# Altium project Intern_assign1.PrjPcb
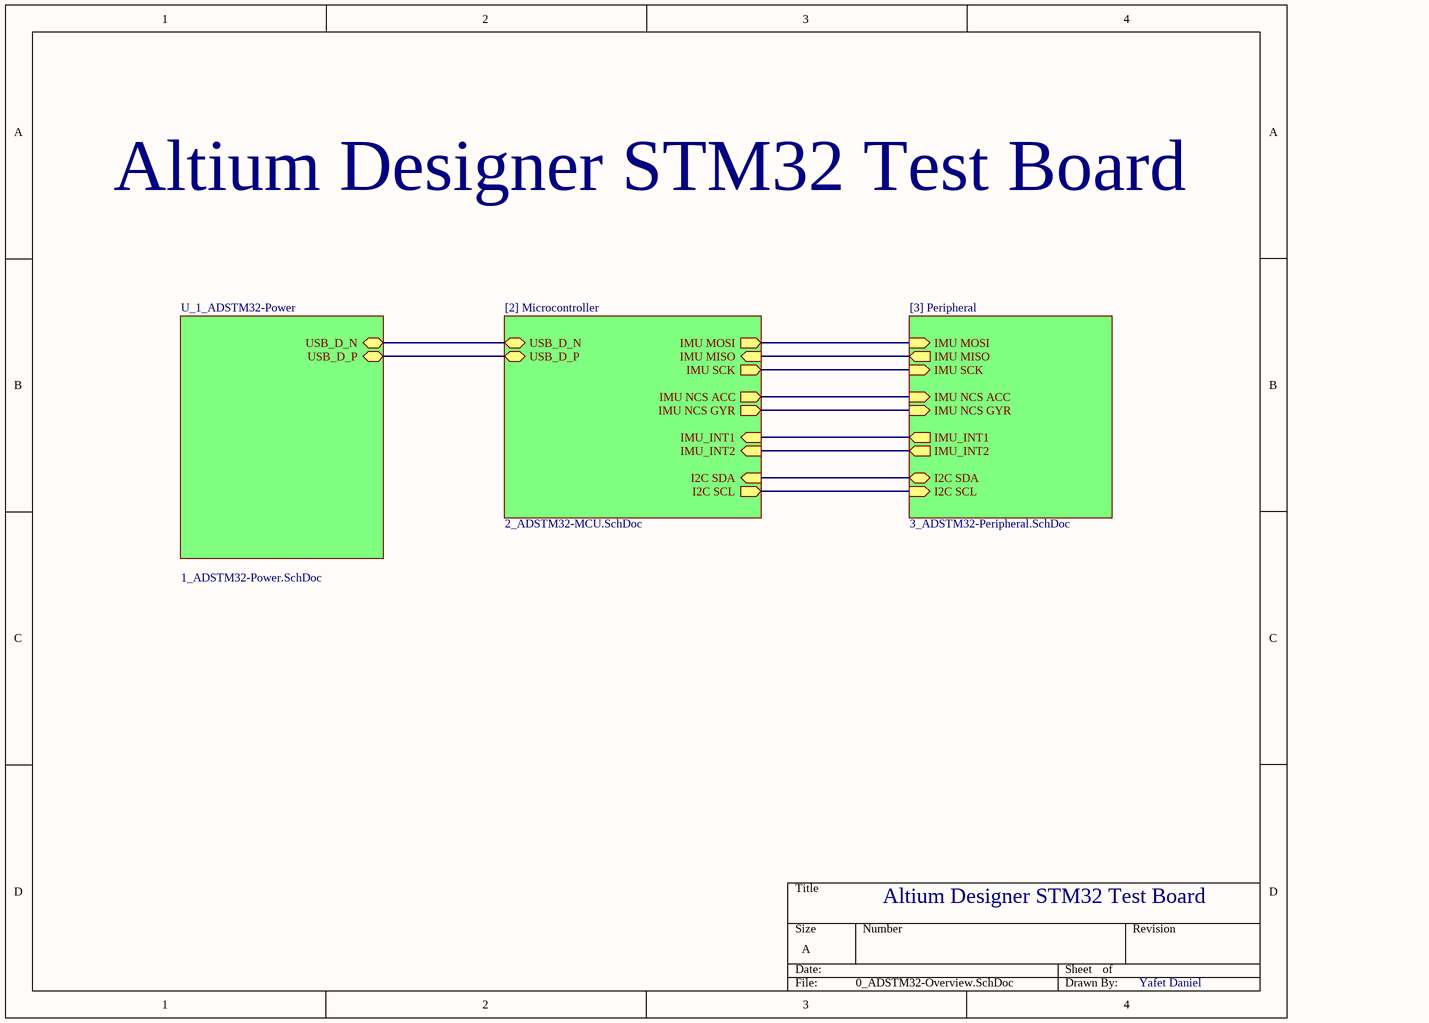
[diagram p0: 0_ADSTM32-Overview.SchDoc]
4 sheets, 30 parts. Net scope: hierarchical (ports join the sheet entries above them; power ports are global).
Board file: ADSTM32-PCB.PcbDoc
Sheets:
  0_ADSTM32-Overview.SchDoc
    U_1_ADSTM32-Power = 1_ADSTM32-Power.SchDoc
    [3] Peripheral = 3_ADSTM32-Peripheral.SchDoc
    [2] Microcontroller = 2_ADSTM32-MCU.SchDoc

## Sheet 0_ADSTM32-Overview.SchDoc
size A; SheetNumber: 1; SheetTotal: 4

### Sub-sheets
[2] Microcontroller = 2_ADSTM32-MCU.SchDoc: USB_D_N (bidir), USB_D_P (bidir), IMU NCS ACC (out), IMU NCS GYR (out), IMU SCK (out), IMU MOSI (out), IMU MISO (in), I2C SCL (out), I2C SDA (in), IMU_INT1 (in), IMU_INT2 (in)
[3] Peripheral = 3_ADSTM32-Peripheral.SchDoc: IMU SCK (in), IMU MOSI (in), IMU MISO (out), IMU NCS ACC (in), IMU NCS GYR (in), IMU_INT1 (out), IMU_INT2 (out), I2C SCL (in), I2C SDA (bidir)
U_1_ADSTM32-Power = 1_ADSTM32-Power.SchDoc: USB_D_N (bidir), USB_D_P (bidir)

### Nets
I2C SCL: sheet [3] Peripheral/I2C SCL, sheet [2] Microcontroller/I2C SCL
I2C SDA: sheet [3] Peripheral/I2C SDA, sheet [2] Microcontroller/I2C SDA
IMU MISO: sheet [3] Peripheral/IMU MISO, sheet [2] Microcontroller/IMU MISO
IMU MOSI: sheet [3] Peripheral/IMU MOSI, sheet [2] Microcontroller/IMU MOSI
IMU NCS ACC: sheet [3] Peripheral/IMU NCS ACC, sheet [2] Microcontroller/IMU NCS ACC
IMU NCS GYR: sheet [3] Peripheral/IMU NCS GYR, sheet [2] Microcontroller/IMU NCS GYR
IMU SCK: sheet [3] Peripheral/IMU SCK, sheet [2] Microcontroller/IMU SCK
USB_D_N: sheet U_1_ADSTM32-Power/USB_D_N, sheet [2] Microcontroller/USB_D_N
USB_D_P: sheet U_1_ADSTM32-Power/USB_D_P, sheet [2] Microcontroller/USB_D_P
NetU200_14: sheet [3] Peripheral/IMU_INT2, sheet [2] Microcontroller/IMU_INT2
NetU200_15: sheet [3] Peripheral/IMU_INT1, sheet [2] Microcontroller/IMU_INT1

### Notes on the sheet
- Altium Designer STM32 Test Board
- Yafet Daniel

## Sheet 1_ADSTM32-Power.SchDoc
size A; SheetNumber: 2; SheetTotal: 4
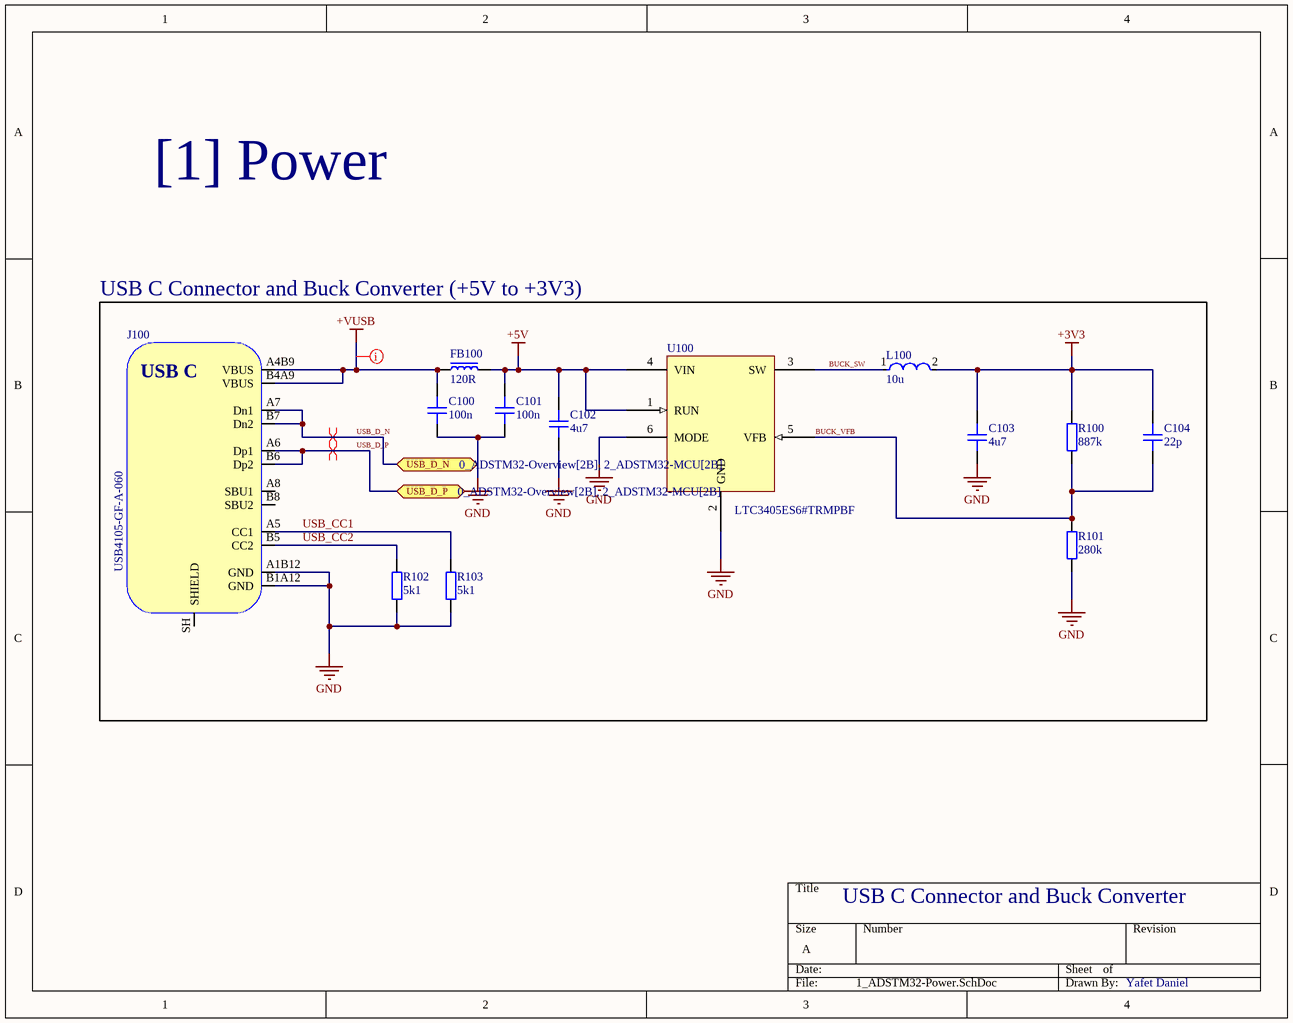
[diagram p1: 1_ADSTM32-Power.SchDoc]

### Parts
C100  100n  [CAP_0603]
C101  100n  [CAP_0603]
C102  4u7  [CAP_0805]
C103  4u7  [CAP_0805]
C104  22p  [CAP_0603]
FB100  120R  [FB_0402]
J100  USB4105-GF-A-060  [USB4105-GF-A-060]
L100  10u  [FP-NRH2412-MFG]
R100  887k  [RES_0603]
R101  280k  [RES_0603]
R102  5k1  [RES_0603]
R103  5k1  [RES_0603]
U100  LTC3405ES6#TRMPBF  [SOT-23-6]

### Blocks framed on the sheet
USB C Connector and Buck Converter (+5V to +3V3): C100-C104 FB100 J100 L100 R100-R103 U100

### Ports
USB_D_N (bidir, see 0_ADSTM32-Overview[2B], 2_ADSTM32-MCU[2B]), USB_D_P (bidir, see 0_ADSTM32-Overview[2B], 2_ADSTM32-MCU[2B])

### Nets
+3V3: C103.2 C104.2 L100.2 R100.2
+5V: C101.2 C102.2 FB100.2 U100.1(RUN) U100.4(VIN)
+VUSB: C100.2 FB100.1 J100.A4B9(VBUS) J100.B4A9(VBUS)
GND: C100.1 C101.1 C102.1 C103.1 J100.A1B12(GND) J100.B1A12(GND) R101.1 R102.1 R103.1 U100.2(GND) U100.6(MODE)
BUCK_SW: L100.1 U100.3(SW)
BUCK_VFB: C104.1 R100.1 R101.2 U100.5(VFB)
USB_CC1: J100.A5(CC1) R103.2
USB_CC2: J100.B5(CC2) R102.2
USB_D_N: J100.A7(Dn1) J100.B7(Dn2) ; port USB_D_N
USB_D_P: J100.A6(Dp1) J100.B6(Dp2) ; port USB_D_P

Not connected (* = marked no-connect by the designer): J100 A8(SBU1) B8(SBU2) SH(SHIELD)

### Layout directives
differential pair: USB_D_N, USB_D_P

### Notes on the sheet
- [1] Power
- USB C Connector and Buck Converter
- Yafet Daniel
- (in symbol USB4105-GF-A-060) USB C

### Library data of the parts
C100 C101 C104 = CAP_0603: Capacitor SMD 0603; Manufacturer: *; Manufacturer Part Number: *; Distributor Link: *; LCSC: *; Rating: *; Dielectric: *
C102 C103 = CAP_0805: Capacitor SMD 0805; Manufacturer: *; Manufacturer Part Number: *; Distributor Link: *; LCSC: *; Rating: *; Dielectric: *
FB100 = FB_0402: Ferrite Bead SMD 0402; Manufacturer: *; Manufacturer Part Number: *; Distributor Link: *; LCSC: *
J100 = USB4105-GF-A-060: USB Connector Type C SMT 12 Pin; Manufacturer: GCT; Manufacturer Part Number: USB4105-GF-A-060; Distributor Link: https://eu.mouser.com/ProductDetail/GCT/USB4105-GF-A-060?qs=QNEnbhJQKvY2mocwNJzgfA%3D%3D; Component Type: Source
L100 = CMP-14484-000582-1: Shielded Wirewound Inductor 10uH 20% 0.51A 0.72Ω SMD; DC Resistance (DCR): 600mR; Current Rating: 450mA; Saturation Current: 810mA; Core Material: Ferrite; Test Frequency: 100kHz; Self Resonant Frequency: 29MHz; Termination: SMD/SMT; Shielding: Shielded; Height - Seated (Max): 0.047inch; Case/Package: Nonstandard; Tolerance: 20%; Height: 1.2mm; Package Quantity: 2500; Mount: Surface Mount; Min Operating Temperature: -25°C; Inductance: 10uH; Width: 0.095inch; Length: 0.095inch; RoHS Compliant: Yes; Max DC Current: 810mA; Packaging: Tape and Reel; Max Operating Temperature: 120°C; Halogen Free: Halogen Free
R100-R103 = RES_0603: Resistor SMD 0603; Manufacturer: *; Manufacturer Part Number: *; Distributor Link: *; LCSC: *
U100 = LTC3405ES6#TRMPBF: 1.5MHz, 300mA / Synchronous Step-Down / Regulator in ThinSOT; Manufacturer: Analog Devices; Manufacturer Part Number: LTC3405ES6#TRMPBF; Component Type: VRM

## Sheet 3_ADSTM32-Peripheral.SchDoc
size A; SheetNumber: 4; SheetTotal: 4
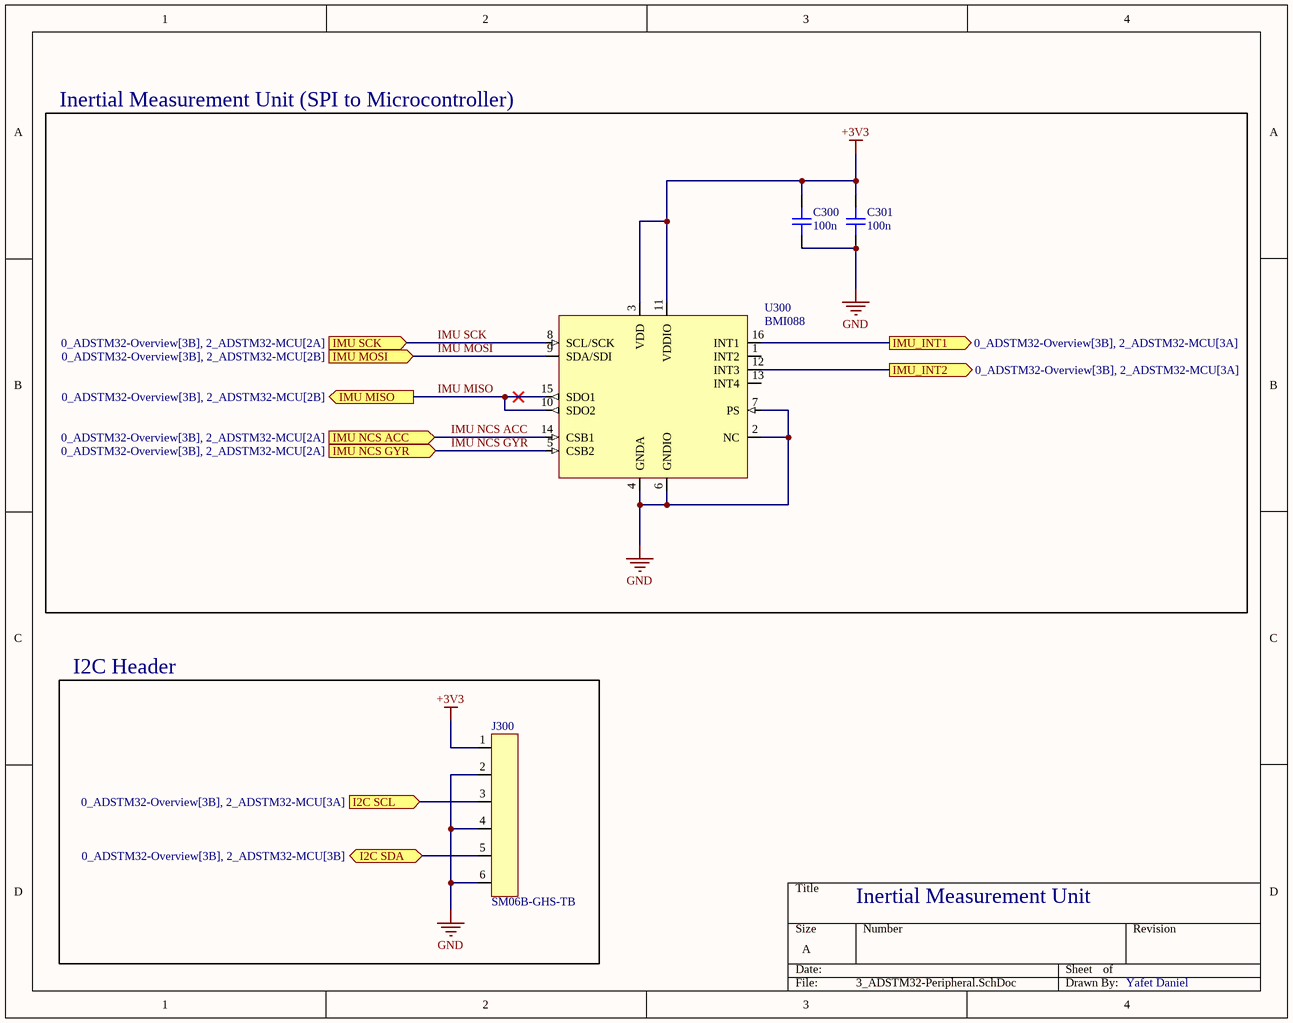
[diagram p2: 3_ADSTM32-Peripheral.SchDoc]

### Parts
C300  100n  [CAP_0603]
C301  100n  [CAP_0603]
J300  SM06B-GHS-TB  [SM06B-GHS-TB]
U300  BMI088  [BMI088]

### Blocks framed on the sheet
Inertial Measurement Unit (SPI to Microcontroller): C300 C301 U300
I2C Header: J300

### Ports
I2C SCL (in, see 0_ADSTM32-Overview[3B], 2_ADSTM32-MCU[3A]), I2C SDA (bidir, see 0_ADSTM32-Overview[3B], 2_ADSTM32-MCU[3B]), IMU MISO (out, see 0_ADSTM32-Overview[3B], 2_ADSTM32-MCU[2B]), IMU MOSI (in, see 0_ADSTM32-Overview[3B], 2_ADSTM32-MCU[2B]), IMU NCS ACC (in, see 0_ADSTM32-Overview[3B], 2_ADSTM32-MCU[2A]), IMU NCS GYR (in, see 0_ADSTM32-Overview[3B], 2_ADSTM32-MCU[2A]), IMU SCK (in, see 0_ADSTM32-Overview[3B], 2_ADSTM32-MCU[2A]), IMU_INT1 (out, see 0_ADSTM32-Overview[3B], 2_ADSTM32-MCU[3A]), IMU_INT2 (out, see 0_ADSTM32-Overview[3B], 2_ADSTM32-MCU[3A])

### Nets
+3V3: C300.2 C301.2 J300.1 U300.3(VDD) U300.11(VDDIO)
GND: C300.1 C301.1 J300.2 J300.4 J300.6 U300.2(NC) U300.4(GNDA) U300.6(GNDIO) U300.7(PS)
I2C SCL: J300.3 ; port I2C SCL
I2C SDA: J300.5 ; port I2C SDA
IMU MISO: U300.10(SDO2) U300.15(SDO1) ; port IMU MISO
IMU MOSI: U300.9(SDA/SDI) ; port IMU MOSI
IMU NCS ACC: U300.14(CSB1) ; port IMU NCS ACC
IMU NCS GYR: U300.5(CSB2) ; port IMU NCS GYR
IMU SCK: U300.8(SCL/SCK) ; port IMU SCK
NetU200_14: U300.12(INT3) ; port IMU_INT2
NetU200_15: U300.16(INT1) ; port IMU_INT1

Not connected (* = marked no-connect by the designer): U300 1(INT2) 13(INT4)

### Notes on the sheet
- Inertial Measurement Unit
- Yafet Daniel

### Library data of the parts
C300 C301 = CAP_0603: Capacitor SMD 0603; Manufacturer: *; Manufacturer Part Number: *; Distributor Link: *; LCSC: *; Rating: *; Dielectric: *
J300 = SM06B-GHS-TB: Header Connector 6 Position 1.25MM Pitch SMD Horizontal JST GH; Manufacturer: JST; Manufacturer Part Number: SM06B-GHS-TB
U300 = BMI088: Inertial Measurement Unit IMU 6-Axis LGA; Manufacturer: Bosch; Current Consumption: 0.006; Manufacturer Part Number: BMI088

## Sheet 2_ADSTM32-MCU.SchDoc
size A; SheetNumber: 3; SheetTotal: 4
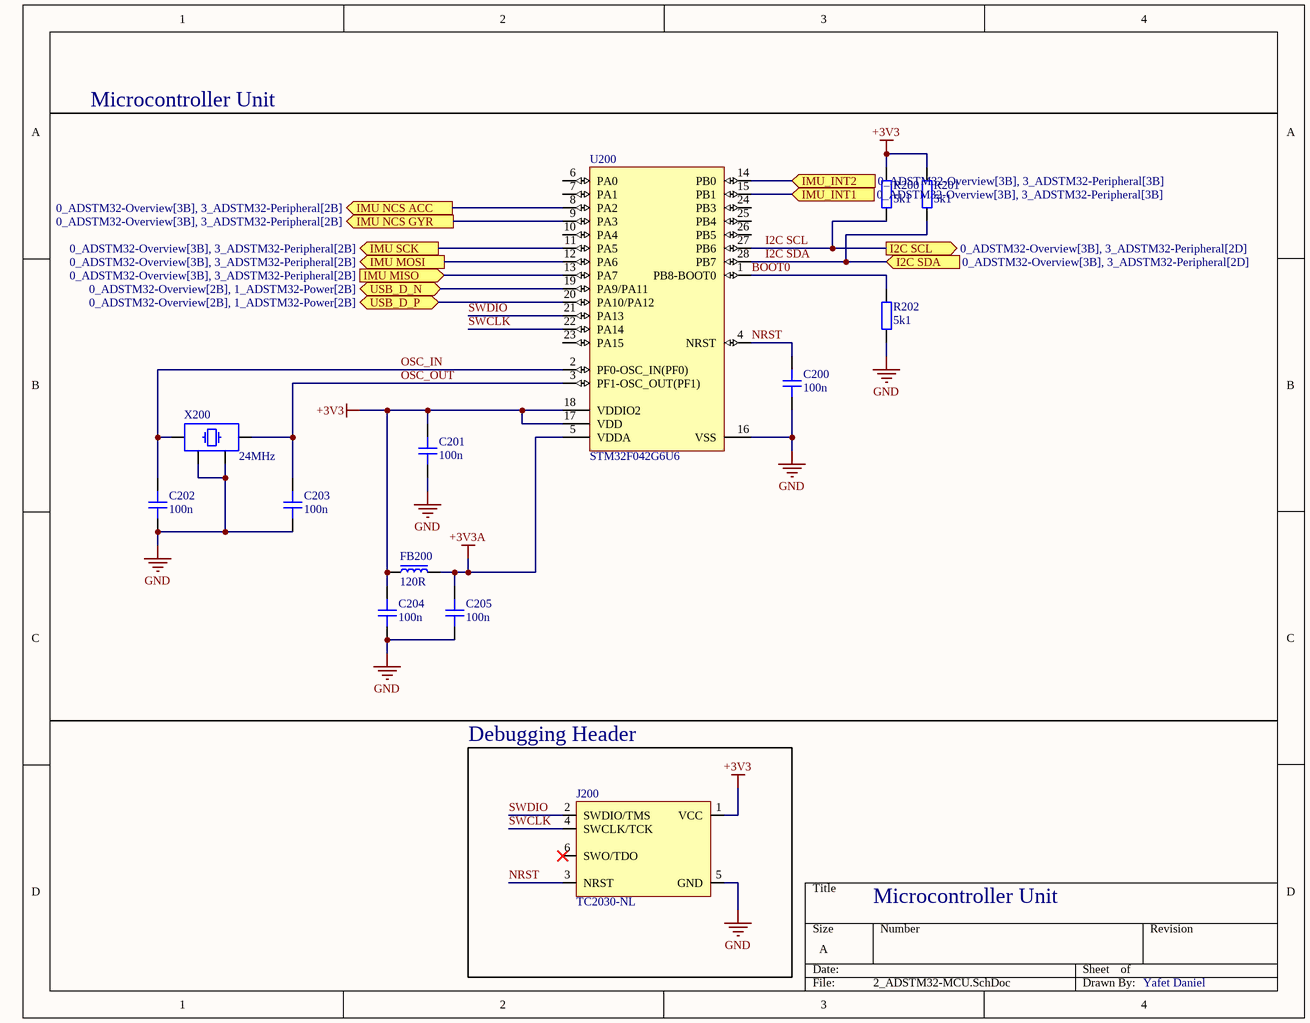
[diagram p3: 2_ADSTM32-MCU.SchDoc]

### Parts
C200  100n  [CAP_0603]
C201  100n  [CAP_0603]
C202  100n  [CAP_0603]
C203  100n  [CAP_0603]
C204  100n  [CAP_0603]
C205  100n  [CAP_0603]
FB200  120R  [FB_0402]
J200  TC2030-NL  [TC2030-NL-FP]  (no BOM)
R200  5k1  [RES_0603]
R201  5k1  [RES_0603]
R202  5k1  [RES_0603]
U200  STM32F042G6U6  [STM-UFQFPN28_V]
X200  24MHz  [XTAL_3225]

### Blocks framed on the sheet
Debugging Header: J200

### Ports
I2C SCL (out, see 0_ADSTM32-Overview[3B], 3_ADSTM32-Peripheral[2D]), I2C SDA (in, see 0_ADSTM32-Overview[3B], 3_ADSTM32-Peripheral[2D]), IMU MISO (in, see 0_ADSTM32-Overview[3B], 3_ADSTM32-Peripheral[2B]), IMU MOSI (out, see 0_ADSTM32-Overview[3B], 3_ADSTM32-Peripheral[2B]), IMU NCS ACC (out, see 0_ADSTM32-Overview[3B], 3_ADSTM32-Peripheral[2B]), IMU NCS GYR (out, see 0_ADSTM32-Overview[3B], 3_ADSTM32-Peripheral[2B]), IMU SCK (out, see 0_ADSTM32-Overview[3B], 3_ADSTM32-Peripheral[2B]), IMU_INT1 (in, see 0_ADSTM32-Overview[3B], 3_ADSTM32-Peripheral[3B]), IMU_INT2 (in, see 0_ADSTM32-Overview[3B], 3_ADSTM32-Peripheral[3B]), USB_D_N (bidir, see 0_ADSTM32-Overview[2B], 1_ADSTM32-Power[2B]), USB_D_P (bidir, see 0_ADSTM32-Overview[2B], 1_ADSTM32-Power[2B])

### Nets
+3V3: C201.2 C204.2 FB200.1 J200.1(VCC) R200.2 R201.2 U200.17(VDD) U200.18(VDDIO2)
+3V3A: C205.2 FB200.2 U200.5(VDDA)
GND: C200.1 C201.1 C202.1 C203.1 C204.1 C205.1 J200.5(GND) R202.1 U200.16(VSS) X200.2 X200.4
BOOT0: R202.2 U200.1(PB8-BOOT0)
I2C SCL: R200.1 U200.27(PB6) ; port I2C SCL
I2C SDA: R201.1 U200.28(PB7) ; port I2C SDA
IMU MISO: U200.13(PA7) ; port IMU MISO
IMU MOSI: U200.12(PA6) ; port IMU MOSI
IMU NCS ACC: U200.8(PA2) ; port IMU NCS ACC
IMU NCS GYR: U200.9(PA3) ; port IMU NCS GYR
IMU SCK: U200.11(PA5) ; port IMU SCK
NRST: C200.2 J200.3(NRST) U200.4(NRST)
OSC_IN: C202.2 U200.2(PF0-OSC_IN(PF0)) X200.1
OSC_OUT: C203.2 U200.3(PF1-OSC_OUT(PF1)) X200.3
SWCLK: J200.4(SWCLK/TCK) U200.22(PA14)
SWDIO: J200.2(SWDIO/TMS) U200.21(PA13)
USB_D_N: U200.19(PA9/PA11) ; port USB_D_N
USB_D_P: U200.20(PA10/PA12) ; port USB_D_P
NetU200_14: U200.14(PB0) ; port IMU_INT2
NetU200_15: U200.15(PB1) ; port IMU_INT1

Not connected (* = marked no-connect by the designer): J200 6(SWO/TDO)*; U200 6(PA0) 7(PA1) 10(PA4) 23(PA15) 24(PB3) 25(PB4) 26(PB5)

### Notes on the sheet
- Microcontroller Unit
- Yafet Daniel

### Library data of the parts
C200-C205 = CAP_0603: Capacitor SMD 0603; Manufacturer: *; Manufacturer Part Number: *; Distributor Link: *; LCSC: *; Rating: *; Dielectric: *
FB200 = FB_0402: Ferrite Bead SMD 0402; Manufacturer: *; Manufacturer Part Number: *; Distributor Link: *; LCSC: *
J200 = TC2030-NL: Tag-Connect No-Solder SWD Debug Connector (No Legs) DO NOT PLACE; Manufacturer: Tag-Connect; Manufacturer Part Number: TC2030-NL-FP
R200-R202 = RES_0603: Resistor SMD 0603; Manufacturer: *; Manufacturer Part Number: *; Distributor Link: *; LCSC: *
U200 = CMP-0304-00112-2: ARM Cortex-M0 32-bit MCU, 32 KB Flash, 6 KB Internal RAM, 24 I/Os, 28-Pin UFQFPN, -40 to 85 degC, Tray; Manufacturer: STMicroelectronics; FLASH Size (Prog) (kB): 32; I/Os (High Current): 24; Internal RAM Size (kB): 6; Supply Voltage(Vcc) min (V): 2; Operating Frequency(F) (Processor speed) (MHz): 48; Current Consumption: 0.025; Power Consumption: 0.0763; Core: ARM Cortex-M0; PartNumber: STM32F042G6U6; Packing: Tray; Package Description: 28-Pin Ultra Thin Fine Pitch Quad Flat No-Lead, 4 x 4 x 0.6 mm Body, 0.5 mm Pitch; ComponentLink2Description: Datasheet; ComponentLink1Description: Manufacturer URL; Package Reference: UFQFPN28; DatasheetVersion: Rev. 5; ComponentLink1URL: http://www.st.com/; ComponentLink2URL: http://www.st.com/st-web-ui/static/active/en/resource/technical/document/datasheet/DM00105814.pdf; Mounting Technology: Surface Mount
X200 = TSX-3225_24.0000MF15X-AC: Crystal SMD 24MHz 10PPM 7pF 3225; Manufacturer: Epson; Manufacturer Part Number: TSX-3225 24.0000MF15X-AC

## Nets that join several sheets
+3V3: 1_ADSTM32-Power (C103.2 C104.2 L100.2 R100.2), 3_ADSTM32-Peripheral (5 pins), 2_ADSTM32-MCU (8 pins)
GND: 1_ADSTM32-Power (11 pins), 3_ADSTM32-Peripheral (9 pins), 2_ADSTM32-MCU (11 pins)
I2C SCL: 3_ADSTM32-Peripheral (J300.3), 2_ADSTM32-MCU (R200.1 U200.27)
I2C SDA: 3_ADSTM32-Peripheral (J300.5), 2_ADSTM32-MCU (R201.1 U200.28)
IMU MISO: 3_ADSTM32-Peripheral (U300.10 U300.15), 2_ADSTM32-MCU (U200.13)
IMU MOSI: 3_ADSTM32-Peripheral (U300.9), 2_ADSTM32-MCU (U200.12)
IMU NCS ACC: 3_ADSTM32-Peripheral (U300.14), 2_ADSTM32-MCU (U200.8)
IMU NCS GYR: 3_ADSTM32-Peripheral (U300.5), 2_ADSTM32-MCU (U200.9)
IMU SCK: 3_ADSTM32-Peripheral (U300.8), 2_ADSTM32-MCU (U200.11)
NetU200_14: 3_ADSTM32-Peripheral (U300.12), 2_ADSTM32-MCU (U200.14)
NetU200_15: 3_ADSTM32-Peripheral (U300.16), 2_ADSTM32-MCU (U200.15)
USB_D_N: 1_ADSTM32-Power (J100.A7 J100.B7), 2_ADSTM32-MCU (U200.19)
USB_D_P: 1_ADSTM32-Power (J100.A6 J100.B6), 2_ADSTM32-MCU (U200.20)